# EAGLE design SMD_tDCS (EAGLE 7.3.0)
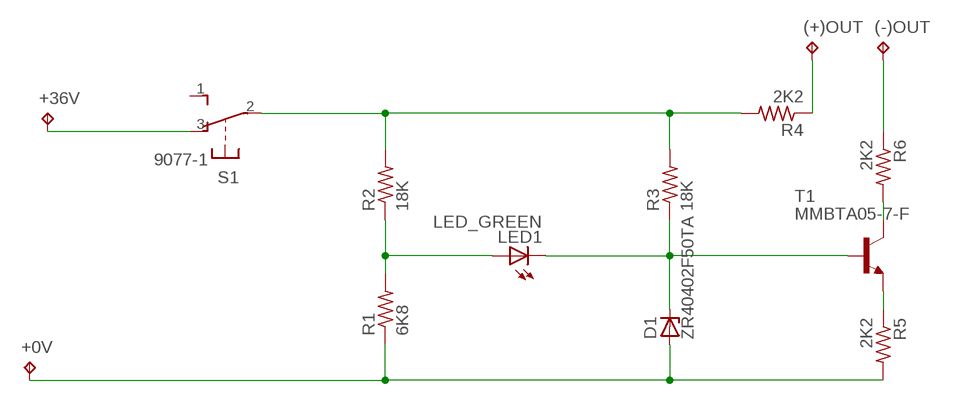
[diagram p0: schematic, sheet 1]

## Parts
(+)OUT  TPTP20SQ  [TP20SQ]
(-)OUT  TPTP20SQ  [TP20SQ]
+0V  TPTP20SQ  [TP20SQ]
+36V  TPTP20SQ  [TP20SQ]
D1  ZR40402F50TA  ZENER-DIODESOT23  [SOT23]
LED1  LED_GREEN  LEDCHIP-LED0805  [CHIP-LED0805]
R1  6K8  R-US_R0402  [R0402]
R2  18K  R-US_R0603  [R0603]
R3  18K  R-US_R0603  [R0603]
R4  2K2  R-US_R2512  [R2512]
R5  2K2  R-US_R2512  [R2512]
R6  2K2  R-US_R2512  [R2512]
S1  9077-1  [9077-1]
T1  MMBTA05-7-F  MMBTA42LT1-NPN-SOT23-BEC  [SOT23-BEC]

## Nets
N$1: LED1.A R1.2 R2.1
N$2: R6.2 T1.C
N$3: +0V.TP D1.1(A) R1.1 R5.2
N$4: (+)OUT.TP R4.1
N$5: (-)OUT.TP R6.1
N$6: R5.1 T1.E
N$7: +36V.TP S1.3(O)
N$8: R2.2 R3.2 R4.2 S1.2(P)
N$9: D1.3(C) LED1.C R3.1 T1.B
Unconnected: S1.1(S)

## Library data of the parts
(+)OUT (-)OUT +0V +36V = testpad:TP: Test pad
D1 = diode:ZENER-DIODE: Z-Diode
LED1 = led:LED: LED OSRAM: - CHIPLED LG R971, LG N971, LY N971, LG Q971, LY Q971, LO R971, LY R971 LH N974, LH R974 LS Q976, LO Q976, LY Q976 LO Q996 - Hyper CHIPLED LW Q18S LB Q993, LB Q99A, LB R99A - SideLED LS A670, LO A670, LY A670, LG A670, LP A670 LB A673, LV A673, LT A673, LW A673 LH A674 LY A675 LS A676, LA A676, LO A676, LY A676, LW A676 LS A679, LY A679, LG A679 - Hyper Micro SIDELED® LS Y876, LA Y876, LO Y876, LY Y876 LT Y87S - SmartLED LW L88C, LW L88S LB L89C, LB L89S, LG L890 LS L89K, LO L89K, LY L89K LS L896, LA L896, LO L896, LY L896 - TOPLED LS T670, LO T670, LY T670, LG T670, LP T670 LSG T670, LSP T670, LSY T670, LOP T670, LYG T670 LG T671, LOG T671, LSG T671 LB T673, LV T673, LT T673, LW T673 LH T674 LS T676, LA T676, LO T676, LY T676, LB T676, LH T676, LSB T676, LW T676 LB T67C, LV T67C, LT T67C, LS T67K, LO T67K, LY T67K, LW E67C LS E67B, LA E67B, LO E67B, LY E67B, LB E67C, LV E67C, LT E67C LW T67C LS T679, LY T679, LG T679 LS T770, LO T770, LY T770, LG T770, LP T770 LB T773, LV T773, LT T773, LW T773 LH T774 LS E675, LA E675, LY E675, LS T675 LS T776, LA T776, LO T776, LY T776, LB T776 LHGB T686 LT T68C, LB T68C - Hyper Mini TOPLED® LB M676 - Mini TOPLED Santana® LG M470 LS M47K, LO M47K, LY M47K Source: http://www.osram.convergy.de LUXEON: - LUMILED® LXK2-PW12-R00, LXK2-PW12-S00, LXK2-PW14-U00, LXK2-PW14-V00 LXK2-PM12-R00, LXK2-PM12-S00, LXK2-PM14-U00 LXK2-PE12-Q00, LXK2-PE12-R00, LXK2-PE12-S00, LXK2-PE14-T00, LXK2-PE14-U00 LXK2-PB12-K00, LXK2-PB12-L00, LXK2-PB12-M00, LXK2-PB14-N00, LXK2-PB14-P00, LXK2-PB14-Q00 LXK2-PR12-L00, LXK2-PR12-M00, LXK2-PR14-Q00, LXK2-PR14-R00 LXK2-PD12-Q00, LXK2-PD12-R00, LXK2-PD12-S00 LXK2-PH12-R00, LXK2-PH12-S00 LXK2-PL12-P00, LXK2-PL12-Q00, LXK2-PL12-R00 Source: www.luxeon.com KINGBRIGHT: KA-3528ASYC Source: www.kingbright.com
R1-R6 = rcl:R-US_: RESISTOR, American symbol
S1 = switch-misc:9077-1: MARQUARDT SWITCH 9077.0100 Distributor: Buerklin <https://www.buerklin.com/default.asp?event=ShowArtikel%2812G2820%29&l=d&jump=ArtNr_12G2820>
T1 = transistor-neu-to92:*-NPN-: NPN Transistror

## Board
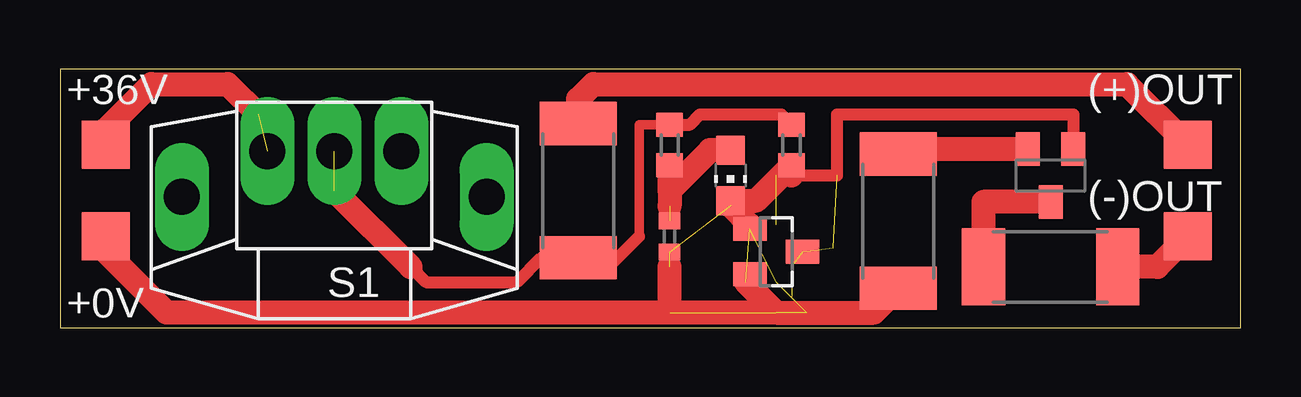
[diagram p1: board, top side]
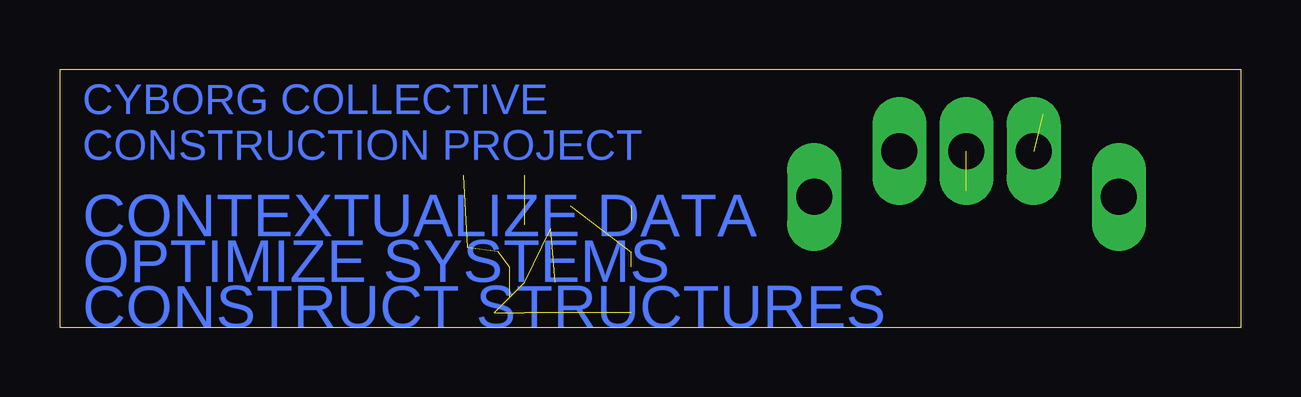
[diagram p2: board, bottom side, seen from below]

Size 49.2 x 10.79 mm. Coordinates in mm from the lower left corner, seen from the top.
Outline: 0,0 49.2,0 49.2,10.79 0,10.79 0,0
Copper layers (1*16): Top 0.035mm / dielectric 1.5mm / Bottom 0.035mm
Design rules "default": minimum track width 10mil, minimum drill 24mil, track to track 8mil, track to pad 8mil, pad to pad 8mil, via to via 8mil, smd to smd 8mil, copper to edge 40mil, drill to drill 8mil, minimum pad ring 10mil, minimum via ring 8mil, stop-mask expansion 4mil, vias tented up to drill 0mil, thermal gap 10mil

### Footprints (pad centres in the part's own frame; a part is rotated, then mirrored left to right if it is on the bottom)
TP20SQ = smd 2 x 2: TP 0,0
SOT23 = smd 1 x 1.4: 1 -0.95,-1.1; 2 0.95,-1.1; 3 0,1.1
CHIP-LED0805 = smd 1.2 x 1.2: A 0,-1.05; C 0,1.05
R0402 = smd 0.7 x 0.9: 1 -0.65,0; 2 0.65,0
R0603 = smd 1 x 1.1: 1 -0.85,0; 2 0.85,0
R2512 = smd 1.8 x 3.2: 1 -2.8,0; 2 2.8,0
9077-1 = drill 1.5 long: 1 -2.794,-1.016; 2 0,-1.016; 3 2.794,-1.016; 4 -6.35,0.889; 5 6.35,0.889
SOT23-BEC = smd 1 x 1.4: B -0.95,-1.1; C 0,1.1; E 0.95,-1.1

### Placement (x,y rotation side)
(+)OUT  46.99,7.62 0 top
(-)OUT  46.99,3.81 0 top
+0V  1.91,3.81 0 top
+36V  1.91,7.62 0 top
D1  29.84,3.17 270 top
LED1  27.94,6.35 180 top
R1  25.4,3.81 90 top
R2  25.4,7.62 90 top
R3  30.48,7.62 90 top
R4  21.59,5.71 270 top
R5  34.92,4.45 270 top
R6  41.27,2.54 180 top
S1  11.43,6.35 180 top
T1  41.27,6.35 180 top

### Tracks (layer width: path | path; a pad name or v marks a point on that pad's centre or on a via)
N$1  (1 unrouted)
  Top 1: 25.4,5.71 R2.1 | LED1.A 27.09,7.4 25.4,5.71 | 25.4,5.71 25.4,5.08
N$2
  Top 1: T1.C 38.48,5.25 R6.2
N$3  (8 unrouted)
  Top 1: 29.84,0.64 33.91,0.64 R5.2 | 29.84,0.64 25.4,0.64 | 25.4,0.64 4.45,0.64 1.91,3.17 +0V.TP | D1.1 28.75,4.28 27.94,5.08 | 29.84,0.64 28.57,1.91 | 25.4,0.64 25.4,2.54
N$4
  Top 1: R4.1 21.59,9.53 22.23,10.16 44.45,10.16 (+)OUT.TP
N$5
  Top 1: (-)OUT.TP 45.72,2.54 R6.1
N$6
  Top 1: T1.E 34.92,7.45 R5.1
N$7  (1 unrouted)
  Top 1: +36V.TP 1.91,8.26 3.81,10.16 6.99,10.16 8.26,8.89
N$8  (1 unrouted)
  Top 0.4: 24.98,8.47 24.13,8.47 24.13,3.81
  Top 0.5: R3.2 30.06,8.89 26.67,8.89 26.25,8.47 R2.2 24.98,8.47 | 14.61,2.54 15.24,1.91 19.05,1.91 20.06,2.92 R4.2 21.96,2.54 22.86,2.54 24.13,3.81
  Top 1: 11.43,5.71 14.61,2.54 | 21.33,3.17 R4.2 21.59,2.54
N$9  (4 unrouted)
  Top 0.5: 30.48,6.35 32.38,6.35 32.38,8.89 42.23,8.89 T1.B
  Top 1: 30.48,6.35 R3.1 29.01,5.3 LED1.C

### Text on the board
Bottom: CYBORG COLLECTIVE | CONSTRUCTION PROJECT | CONTEXTUALIZE DATA | OPTIMIZE SYSTEMS | CONSTRUCT STRUCTURES